# EAGLE design MTX_pic_piggyback_BRW_SOIC_V14 (EAGLE 7.5.0)
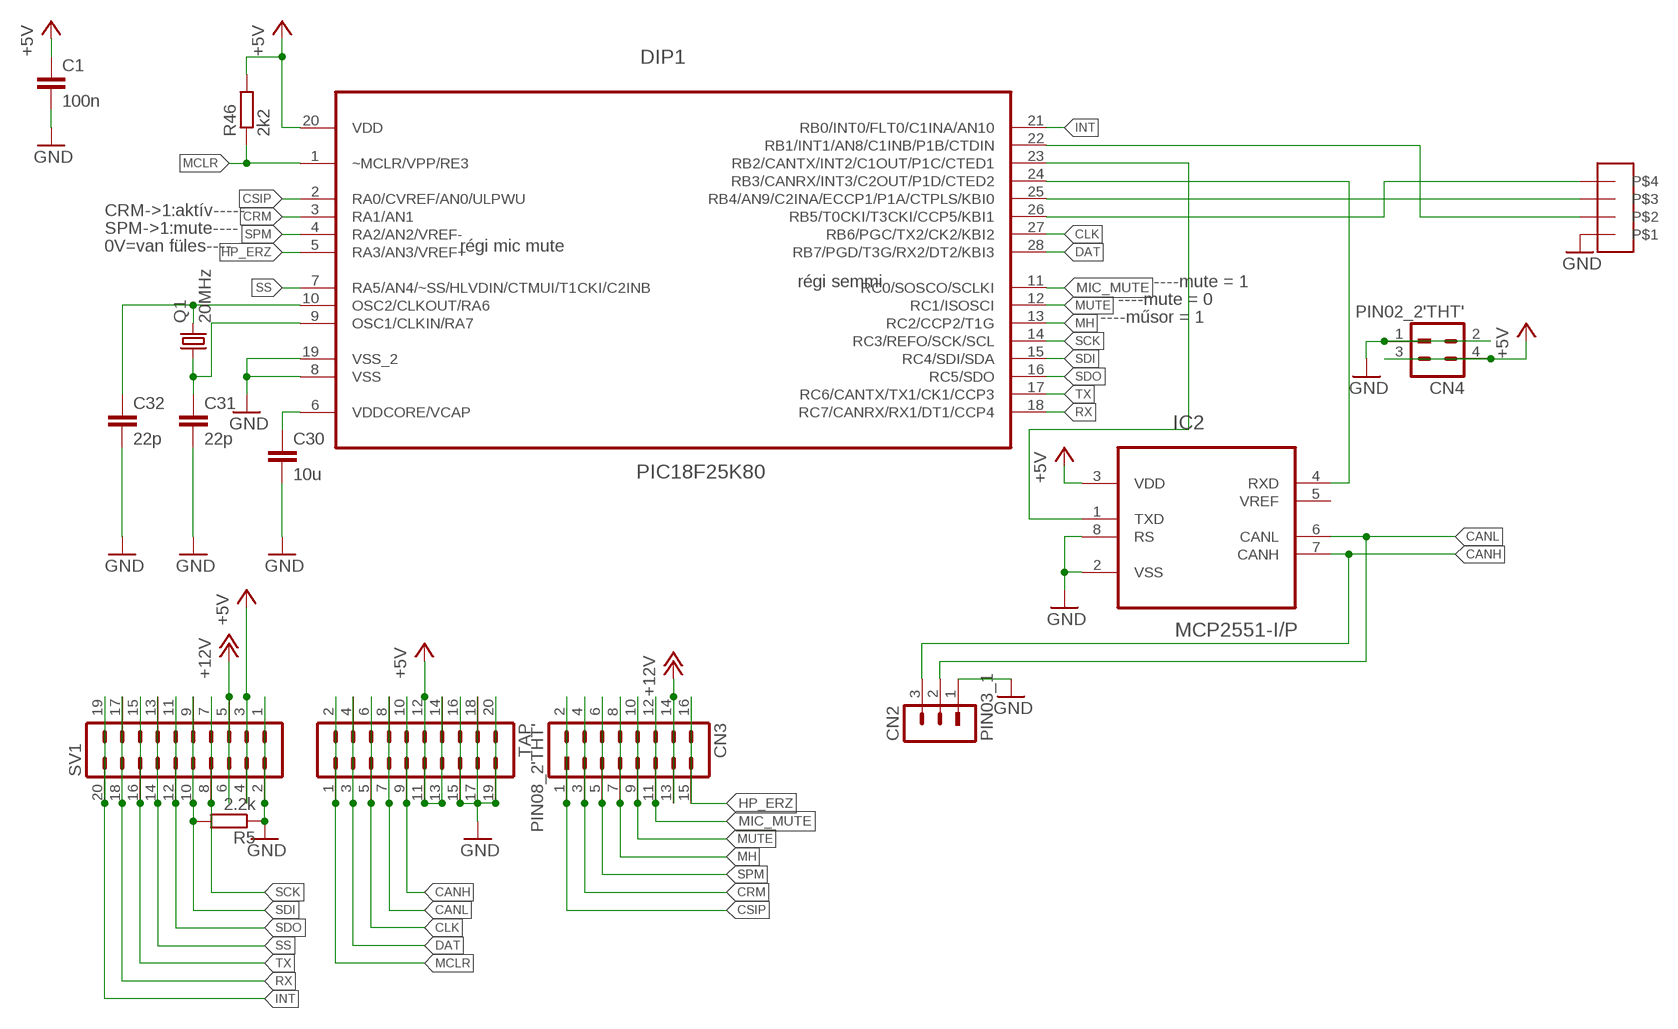
[diagram p0: schematic, sheet 1]

## Parts
C1  100n  C-EUC0805  [C0805]
C30  10u  C-EUC0805  [C0805]
C31  22p  C-EUC0805  [C0805]
C32  22p  C-EUC0805  [C0805]
CN2  PIN03_1  [PIN03_1]
CN3  PIN08_2'THT'  [PIN08_2]
CN4  PIN02_2'THT'  [PIN02_2]
DIP1  PIC18F25K80  [SOIC127P1030X265-28N]
IC2  MCP2551-I/P  [DIP254P762X432-8]
Q1  20MHz  XTAL_2QS  [XTAL_QS]
R5  2.2k  R-EU_R0805  [R0805]
R46  2k2  R-EU_R0805  [R0805]
SV1  MA10-2  [MA10-2]
TAP  MA10-2  [MA10-2]
U$1  FEHER_TUS_4  [FEHER_TUS_4]

## Nets
+5V: C1.1 CN4.3 CN4.4 DIP1.20(VDD) IC2.3(VDD) R46.2 SV1.3 SV1.4 TAP.11 TAP.12 TAP.13 TAP.14
+12V: CN3.13 CN3.14 SV1.5 SV1.6
CANH: CN2.3 IC2.7(CANH) TAP.9 TAP.10
CANL: CN2.2 IC2.6(CANL) TAP.7 TAP.8
CLK: DIP1.27(RB6/PGC/TX2/CK2/KBI2) TAP.5 TAP.6
CRM: CN3.3 CN3.4 DIP1.3(RA1/AN1)
CSIP: CN3.1 CN3.2 DIP1.2(RA0/CVREF/AN0/ULPWU)
DAT: DIP1.28(RB7/PGD/T3G/RX2/DT2/KBI3) TAP.3 TAP.4
GND: C1.2 C30.2 C31.2 C32.2 CN2.1 CN4.1 CN4.2 DIP1.8(VSS) DIP1.19(VSS_2) IC2.2(VSS) IC2.8(RS) R5.1 SV1.1 SV1.2 TAP.15 TAP.16 TAP.17 TAP.18 TAP.19 TAP.20 U$1.P$1
HP_ERZ: CN3.15 CN3.16 DIP1.5(RA3/AN3/VREF+)
INT: DIP1.21(RB0/INT0/FLT0/C1INA/AN10) SV1.19 SV1.20
MCLR: DIP1.1(~MCLR/VPP/RE3) R46.1 TAP.1 TAP.2
MH: CN3.7 CN3.8 DIP1.13(RC2/CCP2/T1G)
MIC_MUTE: CN3.11 CN3.12 DIP1.11(RC0/SOSCO/SCLKI)
MUTE: CN3.9 CN3.10 DIP1.12(RC1/ISOSCI)
N$1: DIP1.23(RB2/CANTX/INT2/C1OUT/P1C/CTED1) IC2.1(TXD)
N$3: DIP1.26(RB5/T0CKI/T3CKI/CCP5/KBI1) U$1.P$4
N$4: DIP1.25(RB4/AN9/C2INA/ECCP1/P1A/CTPLS/KBI0) U$1.P$3
N$5: DIP1.22(RB1/INT1/AN8/C1INB/P1B/CTDIN) U$1.P$2
N$57: C30.1 DIP1.6(VDDCORE/VCAP)
N$58: C31.1 DIP1.9(OSC1/CLKIN/RA7) Q1.1
N$59: C32.1 DIP1.10(OSC2/CLKOUT/RA6) Q1.2
N$86: DIP1.24(RB3/CANRX/INT3/C2OUT/P1D/CTED2) IC2.4(RXD)
RX: DIP1.18(RC7/CANRX/RX1/DT1/CCP4) SV1.17 SV1.18
SCK: DIP1.14(RC3/REFO/SCK/SCL) SV1.7 SV1.8
SDI: DIP1.15(RC4/SDI/SDA) R5.2 SV1.9 SV1.10
SDO: DIP1.16(RC5/SDO) SV1.11 SV1.12
SPM: CN3.5 CN3.6 DIP1.4(RA2/AN2/VREF-)
SS: DIP1.7(RA5/AN4/~SS/HLVDIN/CTMUI/T1CKI/C2INB) SV1.13 SV1.14
TX: DIP1.17(RC6/CANTX/TX1/CK1/CCP3) SV1.15 SV1.16
Unconnected: IC2.5(VREF)

## Notes on the sheet
- CRM->1:aktív-----
- SPM->1:mute----
- 0V=van füles---- | régi mic mute
- régi semmi | ----mute = 1
- ----mute = 0
- ----műsor = 1

## Library data of the parts
C1 C30-C32 = rcl:C-EU: CAPACITOR, European symbol
CN2 = Cf_Csatl:PIN03_1
CN3 = Cf_Csatl:PIN08_2
CN4 = Cf_Csatl:PIN02_2
DIP1 = narval:PIC18F25K80
IC2 = Microchip_By_element14_Batch_1:MCP2551-I/P: High-Speed CAN Transceiver; DESCRIPTION: CAN CTRL; MPN: MCP2551-I/P; OC_FARNELL: 1292240; OC_NEWARK: 61K2947; PACKAGE: PDIP-8; SUPPLIER: Microchip
Q1 = Cf_RLCPX:XTAL_2
R5 R46 = rcl:R-EU_: RESISTOR, European symbol
SV1 TAP = con-lstb:MA10-2: PIN HEADER; OC_FARNELL: unknown; OC_NEWARK: unknown
U$1 = csatik:FEHER_TUS_4

## Board
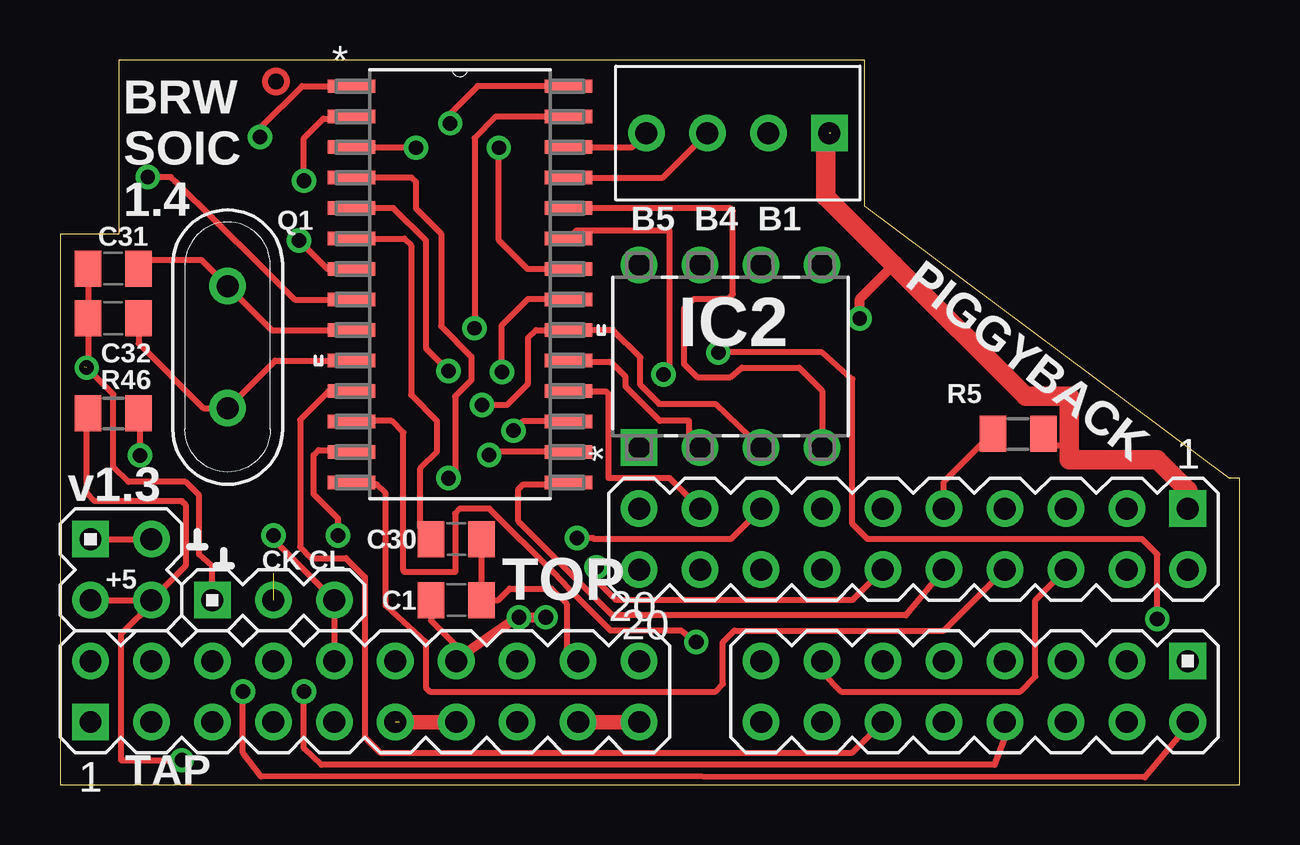
[diagram p1: board, top side]
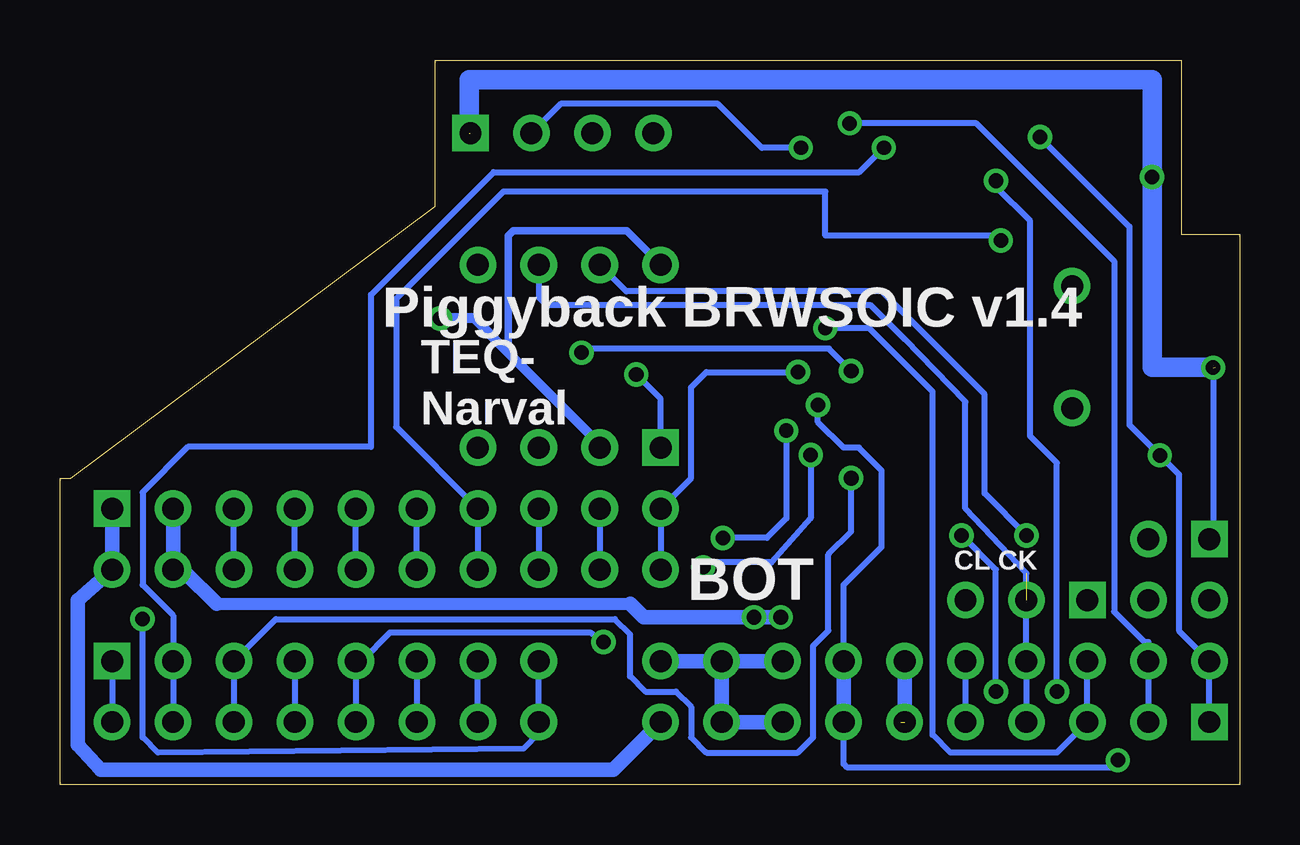
[diagram p2: board, bottom side, seen from below]

Size 49.16 x 30.2 mm. Coordinates in mm from the lower left corner, seen from the top.
Outline: 0,0 49.16,0 49.16,12.78 48.71,12.78 33.53,24.11 33.53,30.2 2.44,30.2 2.44,22.94 0,22.94 0,0
Copper layers (1*16): Top 0.035mm / dielectric 1.5mm / Bottom 0.035mm
Design rules "default": minimum track width 10mil, minimum drill 24mil, track to track 10mil, track to pad 10mil, pad to pad 10mil, via to via 10mil, smd to smd 10mil, copper to edge 10mil, drill to drill 10mil, minimum pad ring 10mil, minimum via ring 8mil, stop-mask expansion 4mil, vias tented up to drill 0mil, thermal gap 10mil

### Footprints (pad centres in the part's own frame; a part is rotated, then mirrored left to right if it is on the bottom)
C0805 = smd 1.1 x 1.5: 1 -1.05,0; 2 1.05,0
PIN03_1 = drill 0.914 pad 1.524 square: 1 -2.54,0 | drill 0.914 pad 1.524: 2 0,0; 3 2.54,0
PIN08_2 = drill 0.914 pad 1.524 square: 1 -7.62,0 | drill 0.914 pad 1.524: 2 -7.62,2.54; 3 -5.08,0; 4 -5.08,2.54; 5 -2.54,0; 6 -2.54,2.54; 7 0,0; 8 0,2.54; 9 2.54,0; 10 2.54,2.54; 11 5.08,0; 12 5.08,2.54; 13 7.62,0; 14 7.62,2.54; 15 10.16,0; 16 10.16,2.54
PIN02_2 = drill 0.914 pad 1.524 square: 1 0,0 | drill 0.914 pad 1.524: 2 0,2.54; 3 2.54,0; 4 2.54,2.54
SOIC127P1030X265-28N = smd 1.981 x 0.559: 1 -4.521,8.255; 2 -4.521,6.985; 3 -4.521,5.715; 4 -4.521,4.445; 5 -4.521,3.175; 6 -4.521,1.905; 7 -4.521,0.635; 8 -4.521,-0.635; 9 -4.521,-1.905; 10 -4.521,-3.175; 11 -4.521,-4.445; 12 -4.521,-5.715; 13 -4.521,-6.985; 14 -4.521,-8.255; 15 4.521,-8.255; 16 4.521,-6.985; 17 4.521,-5.715; 18 4.521,-4.445; 19 4.521,-3.175; 20 4.521,-1.905; 21 4.521,-0.635; 22 4.521,0.635; 23 4.521,1.905; 24 4.521,3.175; 25 4.521,4.445; 26 4.521,5.715; 27 4.521,6.985; 28 4.521,8.255
DIP254P762X432-8 = drill 0.914 pad 1.524 square: 1 -3.81,3.81 | drill 0.914 pad 1.524: 2 -3.81,1.27; 3 -3.81,-1.27; 4 -3.81,-3.81; 5 3.81,-3.81; 6 3.81,-1.27; 7 3.81,1.27; 8 3.81,3.81
XTAL_QS = drill 0.914 pad 1.524: 1 -2.54,0; 2 2.54,0
R0805 = smd 1.1 x 1.5: 1 -1.05,0; 2 1.05,0
MA10-2 = drill 0.914 pad 1.524 square: 1 -11.43,-1.27 | drill 0.914 pad 1.524: 2 -11.43,1.27; 3 -8.89,-1.27; 4 -8.89,1.27; 5 -6.35,-1.27; 6 -6.35,1.27; 7 -3.81,-1.27; 8 -3.81,1.27; 9 -1.27,-1.27; 10 -1.27,1.27; 11 1.27,-1.27; 12 1.27,1.27; 13 3.81,-1.27; 14 3.81,1.27; 15 6.35,-1.27; 16 6.35,1.27; 17 8.89,-1.27; 18 8.89,1.27; 19 11.43,-1.27; 20 11.43,1.27
FEHER_TUS_4 = drill 0.914 pad 1.524 square: P$1 3.81,0 | drill 0.914 pad 1.524: P$2 1.27,0; P$3 -1.27,0; P$4 -3.81,0

### Placement (x,y rotation side)
C1  16.51,7.7 0 top
C30  16.51,10.24 0 top
C31  2.22,21.51 180 top
C32  2.22,19.45 180 top
CN2  8.89,7.7 0 top
CN3  39.37,5.16 180 top
CN4  1.27,10.24 270 top
DIP1  16.66,20.86 0 top
IC2  27.94,17.86 90 top
Q1  6.99,18.24 270 top
R5  39.92,14.62 180 top
R46  2.22,15.48 180 top
SV1  35.56,10.24 180 top
TAP  12.7,3.89 0 top
U$1  28.24,27.16 0 top

### Tracks (layer width: path | path; a pad name or v marks a point on that pad's centre or on a via)
+5V  (via drill 0.6, 0.61, 0.61 pad 1.02)  (1 unrouted)
  Top 0.254: IC2.3 27.3,15.88 24.97,15.88 24.18,16.66 24.18,17.81 23.04,18.95 DIP1.20 19.84,18.95 19.51,18.62 19.51,16.72 18.62,15.83 v17.58,15.83 | CN4.3 CN4.4 | CN4.4 3.97,7.7 2.54,6.27 2.54,1.03 v5.08,1.03 | C1.1 15.46,6.84 16.51,5.79 TAP.14 | 1.17,15.42 R46.2 1.11,15.42 1.11,12.14 1.43,11.83 5.08,11.83 5.24,11.67 5.24,9.13 CN4.4
  Top 0.406: 16.51,5.24 19.05,6.99 v20.24,6.99
  Top 0.61: TAP.14 16.51,5.24 | 14.13,2.62 TAP.13
  Bottom 0.254: TAP.14 16.51,8.33 14.92,9.92 14.92,13.1 15.88,14.05 16.51,14.05 17.58,15.12 v17.58,15.83 | TAP.13 16.51,0.87 16.35,0.71 5.4,0.71 v5.08,1.03
  Bottom 0.508: 42.62,7.54 25.4,7.54
  Bottom 0.61: SV1.3 SV1.4 43.97,8.89 42.62,7.54 | TAP.14 TAP.13 | TAP.12 TAP.11 | 25.4,7.54 24.84,6.99 v20.24,6.99 v19.13,6.99 18.97,6.99
+12V
  Top 0.254: SV1.6 40.72,7.78 40.64,7.7 40.64,4.52 40.01,3.89 32.54,3.89 31.75,4.68 CN3.13
  Bottom 0.254: SV1.6 SV1.5 | CN3.14 CN3.13
CANH  (via drill 0.61 pad 1.02)
  Top 0.254: v8.89,10.4 8.89,10.24 CN2.3 TAP.10
  Bottom 0.254: TAP.10 TAP.9 | v8.89,10.4 10.64,12.14 10.64,16.27 14.92,20.56 25.56,20.56 IC2.7
CANL  (1 unrouted)
  Bottom 0.254: TAP.7 TAP.8 8.89,8.81 11.43,11.51 11.43,15.95 13.97,18.57 15.4,20 28.89,20 29.21,20.32 IC2.6
CLK  (via drill 0.6)
  Top 0.254: DIP1.27 18.16,27.84 17.27,26.95 v17.27,19.03
  Bottom 0.254: TAP.6 TAP.5 7.62,1.35 12.06,1.35 12.8,2.09 12.8,16.39 15.44,19.03 v17.27,19.03
CRM  (via drill 0.6)
  Top 0.254: v14.83,26.55 12.17,26.55 DIP1.3
  Bottom 0.254: CN3.4 CN3.3 44.45,7.06 45.72,8.33 45.72,12.19 43.83,14.08 36.2,14.08 36.2,20.42 31.09,25.53 15.85,25.53 v14.83,26.55
CSIP  (via drill 0.61 pad 1.02)
  Top 0.254: v7.62,3.89 7.62,1.35 8.37,0.36 45.2,0.32 46.99,2.46 CN3.2 | v10.16,25.17 10.16,26.95 10.97,27.77 12.06,27.77 DIP1.2
  Bottom 0.254: CN3.1 CN3.2 | v7.62,3.89 7.62,13.41 8.74,14.53 8.74,23.5 10.16,24.92 v10.16,25.17
DAT  (via drill 0.6)
  Top 0.254: DIP1.28 17.4,29.11 16.26,27.97 v16.26,27.56
  Bottom 0.254: TAP.3 TAP.4 3.81,5.95 3.97,5.95 5.24,7.22 5.24,21.83 10.97,27.56 v16.26,27.56
GND  (via drill 0.6)  (2 unrouted)
  Top 0.254: C31.2 C32.2 1.17,17.44 v1.11,17.38 2.22,16.27 2.22,13.26 2.86,12.62 5.24,12.62 5.79,12.07 5.79,9.6 6.35,9.13 CN2.1 | CN4.2 CN4.1 1.17,10.34 | TAP.18 21.11,5.64 21.11,7.54 20.48,8.18 18.73,8.18 18.26,7.7 C1.2 C30.2 | SV1.1 46.99,11.87 | DIP1.8 9.77,20.22 8.26,21.74 4.8,25.15 4.62,25.33 v3.66,25.33 | IC2.2 26.21,14.51 26.21,15.17 24.99,15.17 23.57,16.59 23.57,17 22.96,17.61 21.26,17.61 DIP1.19 | R5.1 41.44,14.15 42.06,14.15
  Top 0.406: SV1.1 46.94,11.51 | v33.33,19.43 33.33,20.25 34.75,21.67
  Top 0.61: TAP.17 TAP.19 24.35,2.84
  Top 0.813: U$1.P$1 31.9,27 31.9,24.51 34.75,21.67 40.23,16.18 42.06,16.18 42.06,14.15 42.06,13.54 45.72,13.54 46.99,12.27 SV1.1
  Bottom 0.254: v1.11,17.38 1.11,10.4 CN4.1 | 26.62,14.15 26.62,14.1 IC2.2
  Bottom 0.305: IC2.8 25.55,23.09 30.28,23.09 30.48,22.89 30.48,18.01
  Bottom 0.406: 26.62,14.15 30.48,18.01 31.9,19.43 v33.33,19.43
  Bottom 0.61: TAP.15 TAP.17 TAP.18 | TAP.18 TAP.20 | TAP.16 TAP.18 | SV1.1 SV1.2 48.42,7.7 48.42,1.67 47.47,0.64 26.11,0.64 TAP.19
  Bottom 0.813: 1.02,17.4 3.66,17.4 v3.66,25.33 3.66,29.39 32.11,29.39 32.11,27.16
HP_ERZ  (via drill 0.6, 0.61 pad 1.02)
  Top 0.254: v45.72,6.91 45.72,9.6 45.09,10.24 33.66,10.24 33.02,10.87 33.02,16.91 31.75,18.02 v27.44,18.02 v27.43,18.01 | DIP1.5 13.89,24.03 15.24,22.69 15.24,18.2 v16.19,17.24
  Bottom 0.254: v45.72,6.91 45.72,1.98 45.09,1.35 29.84,1.51 29.21,2.14 CN3.16 CN3.15 | v16.19,17.24 17.13,18.18 27.3,18.18 27.3,18.14 v27.43,18.01
INT  (via drill 0.61 pad 1.02)
  Top 0.254: v18.41,17.2 18.41,19.15 19.51,20.25 21.16,20.25 DIP1.21
  Bottom 0.254: v18.41,17.2 22.23,17.2 22.86,16.56 22.86,12.78 SV1.19 SV1.20
MCLR  (via drill 0.6, 0.61 pad 1.02)
  Top 0.254: R46.1 3.33,15.42 v3.33,13.73 3.49,13.89 | DIP1.1 10.08,29.11 8.33,27.36 v8.33,26.99
  Bottom 0.254: TAP.1 TAP.2 2.54,6.43 2.54,12.94 v3.33,13.73 4.6,15 4.6,23.26 v8.33,26.99
MH  (via drill 0.61 pad 1.02)
  Top 0.254: v10.16,3.89 10.16,1.52 10.89,0.83 38.93,0.83 39.37,1.98 CN3.8 | v11.59,10.4 11.59,11.1 10.57,12.12 10.57,13.74 10.77,13.95 12.06,13.95 DIP1.13
  Bottom 0.254: v10.16,3.89 10.16,8.97 v11.59,10.4 | CN3.7 CN3.8
MIC_MUTE
  Top 0.254: CN3.12 33.02,1.35 13.34,1.35 12.7,1.98 12.7,8.65 11.91,9.45 10.48,9.45 10,9.92 10,15.21 11.18,16.39 12.12,16.39 DIP1.11
  Bottom 0.254: CN3.11 CN3.12
MUTE  (via drill 0.61 pad 1.02)
  Top 0.254: v26.51,5.95 25.88,6.43 22.94,6.43 21.19,8.18 20.58,8.82 17.89,11.51 16.66,11.51 16.46,11.31 16.46,8.87 14.41,8.87 arc-90 14.31,8.97 14.31,14.68 13.82,15.17 12.17,15.17 DIP1.12
  Bottom 0.254: v26.51,5.95 27.07,6.35 35.4,6.35 36.59,5.16 CN3.9 CN3.10
N$1  (via drill 0.61 pad 1.02)
  Top 0.254: v25.15,17.1 25.4,17.35 25.4,23.09 21.51,23.09 DIP1.23
  Bottom 0.254: IC2.1 24.13,16.08 v25.15,17.1
N$3
  Top 0.254: DIP1.26 23.85,26.57 U$1.P$4
N$4
  Top 0.254: DIP1.25 25.12,25.3 U$1.P$3
N$5  (via drill 0.6)
  Top 0.254: DIP1.22 19.48,21.49 18.29,22.69 v18.29,26.55
  Bottom 0.254: v18.29,26.55 19.91,26.55 21.74,28.38 28.3,28.38 U$1.P$2
N$57
  Top 0.254: C30.1 | DIP1.6 14.35,22.76 14.63,22.48 14.63,16.25 15.72,15.16 15.72,13.89 15.01,13.19 15.01,10.69 arc90 C30.1
N$58
  Top 0.254: C31.1 3.63,21.87 5.89,21.87 Q1.1 8.81,18.95 DIP1.9
N$59
  Top 0.254: C32.1 3.27,18.4 5.97,15.7 Q1.2 8.97,17.68 DIP1.10
N$86
  Top 0.254: IC2.4 31.75,16.43 30.8,17.38 28.42,17.38 27.94,16.99 26.56,16.99 26.01,17.53 26.01,19.84 26.42,20.25 27.84,20.25 28.04,20.45 28.04,23.9 27.91,24.03 DIP1.24
RX
  Top 0.254: SV1.17 25.4,12.78 22.86,12.78 22.86,16.28 22.76,16.39 21.21,16.39 DIP1.18
  Bottom 0.254: SV1.17 SV1.18
SCK
  Top 0.254: SV1.8 36.83,6.43 28.1,6.43 27.62,5.95 27.62,4.21 27.3,3.89 15.4,3.89 15.24,4.05 15.24,5.95 13.56,7.47 13.56,12.17 13.21,12.53 12.22,12.53 DIP1.14
  Bottom 0.254: SV1.8 SV1.7
SDI
  Top 0.254: SV1.10 35.24,7.06 23.02,7.06 19.1,10.98 19.1,12.32 19.3,12.53 21.11,12.53 DIP1.15 | SV1.9 36.83,12.62 38.83,14.62 R5.2
  Bottom 0.254: SV1.10 SV1.9
SDO  (via drill 0.6)
  Top 0.254: SV1.12 33.02,7.7 23.18,7.7 22.3,8.57 22.35,8.62 v22.35,9.07 | DIP1.16 18.01,13.87 v17.88,13.74
  Bottom 0.254: SV1.12 SV1.11 | v17.88,13.74 17.88,11.1 19.51,9.27 22.15,9.27 v22.35,9.07
SPM  (via drill 0.61 pad 1.02)
  Top 0.254: DIP1.4 14.66,25.3 14.83,25.12 14.83,24.01 15.88,22.96 15.88,19.11 17.14,17.84 17.14,16.87 16.46,16.18 16.46,13.05 v16.19,12.78
  Bottom 0.254: v16.19,12.78 16.19,10.56 17.14,9.6 17.14,6.43 17.78,5.79 17.78,1.98 18.41,1.35 22.23,1.35 22.86,1.98 22.86,3.25 23.5,3.89 24.77,3.89 25.4,4.52 25.4,6.27 26.04,6.91 40.16,6.91 CN3.5 CN3.6
SS  (via drill 0.6)
  Top 0.254: DIP1.7 11.15,21.49 v9.96,22.69
  Bottom 0.254: SV1.14 SV1.13 35.15,14.91 35.15,20.25 30.68,24.72 17.27,24.72 17.27,22.89 10.16,22.89 v9.96,22.69
TX  (via drill 0.6)
  Top 0.254: SV1.15 27.94,10.24 22.25,10.24 22.2,10.29 v21.54,10.29 | DIP1.17 19.28,15.14 v18.9,14.76
  Bottom 0.254: SV1.15 SV1.16 | v18.9,14.76 18.9,11.1 19.71,10.29 v21.54,10.29
(copper drawn outside any net)
  shapes: Top circle x1

### Text on the board
tNames: BRW / SOIC / 1.4 | B5 | B4 | B1 | PIGGYBACK | v1.3 | CK CL | +5 | TOP
bNames: Piggyback BRWSOIC v1.4 | TEQ- / Narval | CL CK | BOT
tTest: RX | TX | SS | SDO | SDI | CLK | 12V | 5V | INT